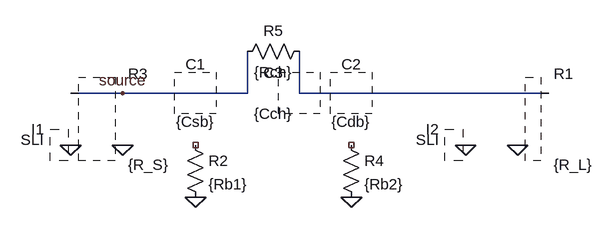
[diagram p0: schematic shuntswitch_imp.asc]
shuntswitch_imp.asc, the LTspice schematic file:
Version 4
SHEET 1 1144 680
WIRE -416 64 -496 64
WIRE -304 64 -416 64
WIRE -224 64 -224 0
WIRE -224 64 -304 64
WIRE -144 64 -144 0
WIRE -64 64 -144 64
WIRE 112 64 -64 64
WIRE 192 64 112 64
WIRE 240 64 192 64
FLAG -416 144 0
FLAG -416 64 source
FLAG 192 144 0
FLAG -496 144 0
FLAG 112 144 0
FLAG -304 224 0
FLAG -64 224 0
SYMBOL SLR 192 64 R0
SYMATTR InstName R1
SYMATTR Value {R_L}
SYMBOL SLR_r -416 64 R0
SYMATTR InstName R3
SYMATTR Value {R_S}
SYMATTR SpiceLine ""
SYMBOL SLI -496 144 R180
WINDOW 0 41 24 Left 2
WINDOW 3 41 8 Left 2
WINDOW 123 41 -28 Left 2
WINDOW 39 41 -4 Left 2
WINDOW 40 41 -16 Left 2
SYMATTR InstName I1
SYMBOL SLI 112 144 R180
WINDOW 0 41 24 Left 2
WINDOW 3 41 8 Left 2
WINDOW 123 41 -28 Left 2
WINDOW 39 41 -4 Left 2
WINDOW 40 41 -16 Left 2
SYMATTR InstName I2
SYMBOL SLC -304 64 R0
SYMATTR InstName C1
SYMATTR Value {Csb}
SYMBOL SLC -64 64 R0
SYMATTR InstName C2
SYMATTR Value {Cdb}
SYMBOL res -320 128 R0
SYMATTR InstName R2
SYMATTR Value {Rb1}
SYMBOL res -80 128 R0
SYMATTR InstName R4
SYMATTR Value {Rb2}
SYMBOL res -128 -16 R90
WINDOW 0 0 56 VBottom 2
WINDOW 3 32 56 VTop 2
SYMATTR InstName R5
SYMATTR Value {Rch}
SYMBOL SLC -144 64 R90
WINDOW 0 -16 40 VBottom 2
WINDOW 3 16 40 VTop 2
WINDOW 123 28 40 VTop 2
SYMATTR InstName C3
SYMATTR Value {Cch}

The netlist it stands for:
* shuntswitch_imp.asc
* R1: {R_L} (symbol SLR not available, pin order unknown); nets seen at it: 0, N001
* R3: {R_S} (symbol SLR_r not available, pin order unknown); nets seen at it: 0, source
* I1: SLI (symbol SLI not available, pin order unknown); nets seen at it: 0
* I2: SLI (symbol SLI not available, pin order unknown); nets seen at it: 0
* C1: {Csb} (symbol SLC not available, pin order unknown); nets seen at it: 
* C2: {Cdb} (symbol SLC not available, pin order unknown); nets seen at it: 
R2 NC_01 0 {Rb1}
R4 NC_02 0 {Rb2}
R5 N001 source {Rch}
* C3: {Cch} (symbol SLC not available, pin order unknown); nets seen at it: 
.backanno
.end